# Altium schematic sheet Dashboard.SchDoc
size A
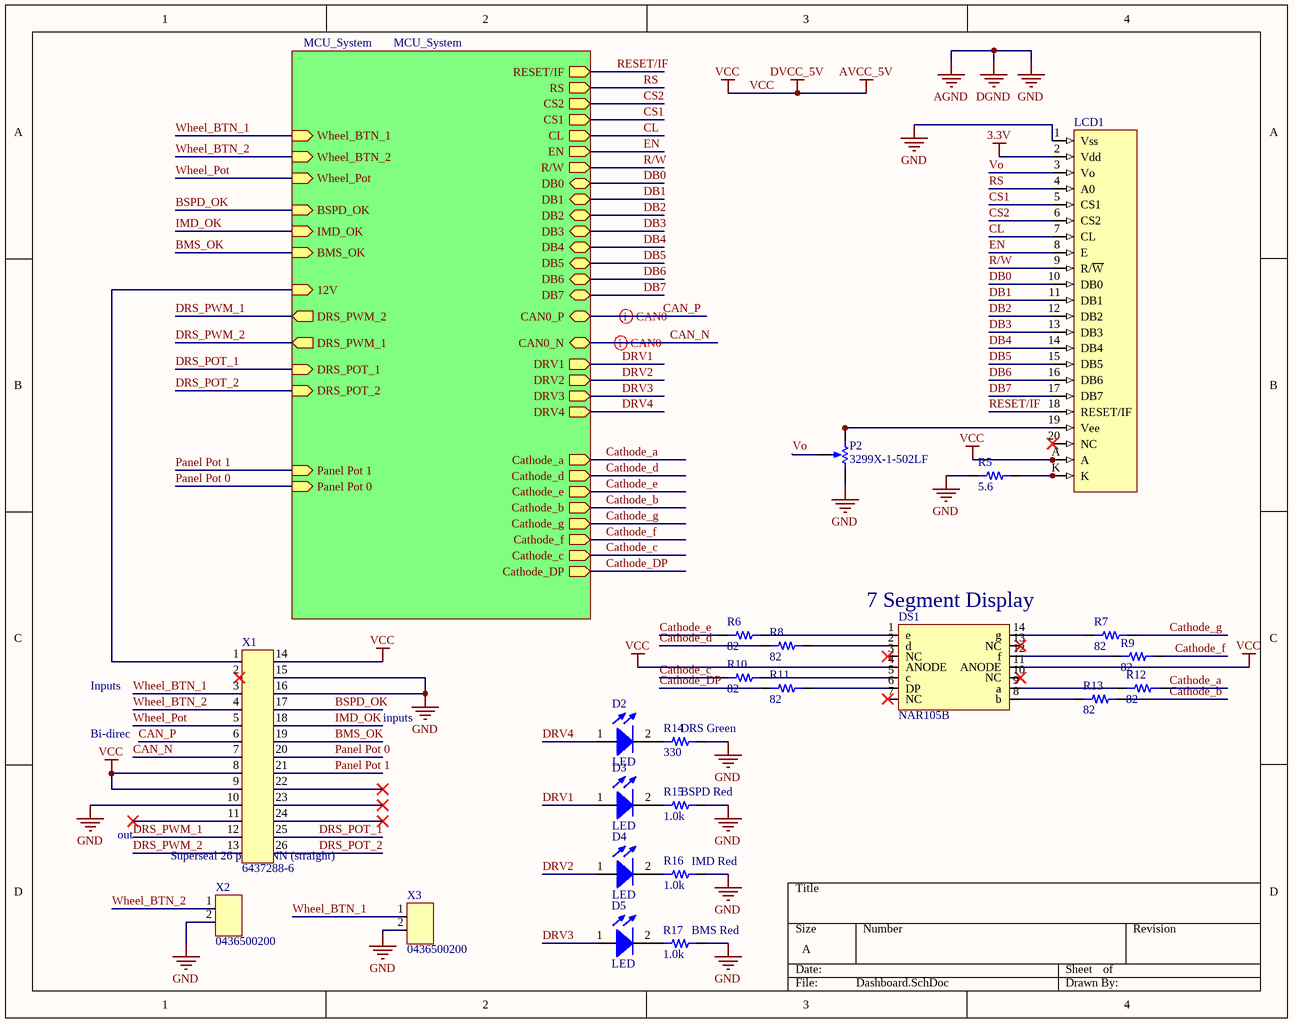
[diagram p0: Dashboard.SchDoc]

## Parts
D2  LED  [LED TH]
D3  LED  [LED TH]
D4  LED  [LED TH]
D5  LED  [LED TH]
DS1  NAR105B  [Stanley7Seg]
LCD1  (no value)  [NHD-12232]
P2  3299X-1-502LF  [3299X-1-502LF]
R5  value 5.6  [RES 0805/2012]  (hidden comment: Resistor 5.6 0805 1/2W 1%)
R6  value 82  [RES 0805/2012]  (hidden comment: Resistor 82 0805 1/4W 5%)
R7  value 82  [RES 0805/2012]  (hidden comment: Resistor 82 0805 1/4W 5%)
R8  value 82  [RES 0805/2012]  (hidden comment: Resistor 82 0805 1/4W 5%)
R9  value 82  [RES 0805/2012]  (hidden comment: Resistor 82 0805 1/4W 5%)
R10  value 82  [RES 0805/2012]  (hidden comment: Resistor 82 0805 1/4W 5%)
R11  value 82  [RES 0805/2012]  (hidden comment: Resistor 82 0805 1/4W 5%)
R12  value 82  [RES 0805/2012]  (hidden comment: Resistor 82 0805 1/4W 5%)
R13  value 82  [RES 0805/2012]  (hidden comment: Resistor 82 0805 1/4W 5%)
R14  value 330  [RES 0805/2012]  (hidden comment: Resistor 330 0805 1/4W 5%)
R15  value 1.0k  [RES 0805/2012]  (hidden comment: Resistor 1.0k 0805 1/4W 5%)
R16  value 1.0k  [RES 0805/2012]  (hidden comment: Resistor 1.0k 0805 1/4W 5%)
R17  value 1.0k  [RES 0805/2012]  (hidden comment: Resistor 1.0k 0805 1/4W 5%)
X1  6437288-6  [TE_Amp_6437288-6]
X2  0436500200  [CONN 43650-0200 MOLEX 2PIN]
X3  0436500200  [CONN 43650-0200 MOLEX 2PIN]

## Sub-sheets
MCU_System = MCU_System: Wheel_BTN_2 (in), Wheel_BTN_1 (in), Wheel_Pot (in), CAN0_N (bidir), CAN0_P (bidir), 12V (in), DRS_PWM_2 (out), DRS_PWM_1 (out), BMS_OK (in), IMD_OK (in), BSPD_OK (in), EN (out), R/W (out), CS2 (out), CS1 (out), RS (out), RESET/IF (out), CL (out), DRV2 (out), DRV3 (out), DRV1 (out), DRS_POT_1 (in), DRS_POT_2 (in), DB7 (bidir), DB3 (bidir), DB4 (bidir), DB5 (bidir), DB6 (bidir), DB1 (bidir), DB2 (bidir), DB0 (bidir), DRV4 (out), Cathode_a (out), Cathode_d (out), Cathode_e (out), Cathode_b (out), Cathode_g (out), Cathode_f (out), Cathode_c (out), Cathode_DP (out), Panel Pot 1 (in), Panel Pot 0 (in)

## Nets
3.3V: LCD1.2(Vdd)
AGND: LCD1.1(Vss) P2.3(BOT) R5.1 R14.2 R15.2 R16.2 R17.2 X1.10 X1.15 X1.16 X2.2 X3.2  [also labelled DGND, GND]
VCC: DS1.4(ANODE) DS1.11(ANODE) LCD1.A LCD1.A2(A) X1.8 X1.9 X1.14  [also labelled AVCC_5V, DVCC_5V]
BMS_OK: X1.19 ; sheet MCU_System/BMS_OK
BSPD_OK: X1.17 ; sheet MCU_System/BSPD_OK
CAN_N: X1.7 ; sheet MCU_System/CAN0_N
CAN_P: X1.6 ; sheet MCU_System/CAN0_P
Cathode_a: R12.2 ; sheet MCU_System/Cathode_a
Cathode_b: R13.2 ; sheet MCU_System/Cathode_b
Cathode_c: R10.1 ; sheet MCU_System/Cathode_c
Cathode_d: R8.1 ; sheet MCU_System/Cathode_d
Cathode_DP: R11.1 ; sheet MCU_System/Cathode_DP
Cathode_e: R6.1 ; sheet MCU_System/Cathode_e
Cathode_f: R9.2 ; sheet MCU_System/Cathode_f
Cathode_g: R7.2 ; sheet MCU_System/Cathode_g
CL: LCD1.7(CL) ; sheet MCU_System/CL
CS1: LCD1.5(CS1) ; sheet MCU_System/CS1
CS2: LCD1.6(CS2) ; sheet MCU_System/CS2
DB0: LCD1.10(DB0) ; sheet MCU_System/DB0
DB1: LCD1.11(DB1) ; sheet MCU_System/DB1
DB2: LCD1.12(DB2) ; sheet MCU_System/DB2
DB3: LCD1.13(DB3) ; sheet MCU_System/DB3
DB4: LCD1.14(DB4) ; sheet MCU_System/DB4
DB5: LCD1.15(DB5) ; sheet MCU_System/DB5
DB6: LCD1.16(DB6) ; sheet MCU_System/DB6
DB7: LCD1.17(DB7) ; sheet MCU_System/DB7
DRS_POT_1: X1.25 ; sheet MCU_System/DRS_POT_1
DRS_POT_2: X1.26 ; sheet MCU_System/DRS_POT_2
DRS_PWM_1: X1.12 ; sheet MCU_System/DRS_PWM_2
DRS_PWM_2: X1.13 ; sheet MCU_System/DRS_PWM_1
DRV1: D3.1(A) ; sheet MCU_System/DRV1
DRV2: D4.1(A) ; sheet MCU_System/DRV2
DRV3: D5.1(A) ; sheet MCU_System/DRV3
DRV4: D2.1(A) ; sheet MCU_System/DRV4
EN: LCD1.8(E) ; sheet MCU_System/EN
IMD_OK: X1.18 ; sheet MCU_System/IMD_OK
Panel Pot 0: X1.20 ; sheet MCU_System/Panel Pot 0
Panel Pot 1: X1.21 ; sheet MCU_System/Panel Pot 1
R/W: LCD1.9(R/~{W}) ; sheet MCU_System/R/W
RESET/IF: LCD1.18(RESET/IF) ; sheet MCU_System/RESET/IF
RS: LCD1.4(A0) ; sheet MCU_System/RS
Vo: LCD1.3(Vo) P2.2(TAP)
Wheel_BTN_1: X1.3 X3.1 ; sheet MCU_System/Wheel_BTN_1
Wheel_BTN_2: X1.4 X2.1 ; sheet MCU_System/Wheel_BTN_2
Wheel_Pot: X1.5 ; sheet MCU_System/Wheel_Pot
NetD2_2: D2.2(K) R14.1
NetD3_2: D3.2(K) R15.1
NetD4_2: D4.2(K) R16.1
NetD5_2: D5.2(K) R17.1
NetDS1_1: DS1.1(e) R6.2
NetDS1_2: DS1.2(d) R8.2
NetDS1_5: DS1.5(c) R10.2
NetDS1_6: DS1.6(DP) R11.2
NetDS1_8: DS1.8(b) R13.1
NetDS1_9: DS1.9(a) R12.1
NetDS1_12: DS1.12(f) R9.1
NetDS1_14: DS1.14(g) R7.1
NetLCD1_19: LCD1.19(Vee) P2.1(TOP)
NetLCD1_K: LCD1.K LCD1.K2(K) R5.2
NetX1_1: X1.1 ; sheet MCU_System/12V

Not connected (* = marked no-connect by the designer): DS1 3(NC)* 7(NC)* 10(NC)* 13(NC)*; LCD1 20(NC)*; X1 2* 11* 22* 23* 24*

## Layout directives
differential pair; rule Matched Net Lengths [Tolerance = 25.4mm]: CAN_N, CAN_P

## Notes on the sheet
- (near DS1) 7 Segment Display
- Inputs
- Bi-direc
- inputs
- (near R14) DRS Green
- out
- (near R15) BSPD Red
- (near X1) Superseal 26 pin CONN (straight)
- (near R16) IMD Red
- (near R17) BMS Red

## Library data of the parts
D2 = 4: LED GREEN DIFFUSED T/H; Manufacturer_id: 1; MfrPartNo: LTL-10233W; idLED: 4; Name: LED_TH_GREEN; Vf: 2.1V; Drawer_id: 1; Value: Green; Package: TH; Link: https://www.digikey.com/products/en?mpart=LTL-10233W&v=160
D3-D5 = 3: LED RED DIFFUSED T/H; Manufacturer_id: 1; MfrPartNo: LTL2R3KRD-EM; idLED: 3; Name: LED_TH_RED; Brightness: 50mcd; Id: 2mA; Vf: 1.8V; Drawer_id: 1; Value: Red; Package: TH; Link: https://www.digikey.com/products/en?mpart=LTL2R3KRD-EM&v=160
DS1 = 21: Character LED Display Module Red 7-Segment 1 Character Common Anode 3.4V 20mA 1.299" H x 0.898" W x 0.354" D (33.00mm x 22.80mm x 9.00mm) 14-DIP; Manufacturer_id: 7; idIC_Misc: 21; Drawer_id: 1; Name: 7_Seg_Disp; Type: 7 Segment; Protocol: Multiplexed; Vin(Max): 3.3V; MfrPartNo: NAR105B; Num_Circuits: 1; Package: DIP; Link: https://www.digikey.com/product-detail/en/stanley-electric-co/NAR105B/404-1126-ND/428836
LCD1 = 22: MfrPartNo: NHD-12232WG-EYYH-V#A-ND; Manufacturer_id: 10; idIC_Misc: 22; Drawer_id: 1; Name: NHD-12232 Display; Value: LCD Display; Vin(Min): 2.7V; Vin(Max): 3.3V; ComponentLink1Description: Datasheet; ComponentLink1URL: http://www.newhavendisplay.com/specs/NHD-12232WG-EYYH-VA.pdf
P2 = 6: Manufacturer_id: 1; idTable: 6; Value: 5K; Num_Contacts: 3; Pitch: 2.54mm; Drawer_id: 1; Name: 3299X-1-502LF; MfrPartNo: 3299X-1-502LF; Link: https://www.digikey.com/product-detail/en/bourns-inc/3299X-1-502LF/3299X-502LF-ND/1088167; ComponentLink1Description: Datasheet
R5 = 883: Manufacturer_id: 1; idResistor: 883; Name: Res_5.6_0805_1/2W_1%; Created_By: Nick Mah; Supplier 1: Digi-Key; Drawer_id: 1; Tolerance: 1%; Power: 1/2W; Package: 0805; ComponentLink1Description: Datasheet; Created_Date: 2018-10-20
R6-R13 = 1775: Manufacturer_id: 1; idResistor: 1775; Name: Res_82_0805_1/4W_5%; Created_By: Nick Mah; Supplier 1: Digi-Key; Drawer_id: 1; Tolerance: 5%; Power: 1/4W; Package: 0805; ComponentLink1Description: Datasheet; Created_Date: 2018-10-20
R14 = 1789: Manufacturer_id: 1; idResistor: 1789; Name: Res_330_0805_1/4W_5%; Created_By: Nick Mah; Supplier 1: Digi-Key; Drawer_id: 1; Tolerance: 5%; Power: 1/4W; Package: 0805; ComponentLink1Description: Datasheet; Created_Date: 2018-10-20
R15-R17 = 1801: Manufacturer_id: 1; idResistor: 1801; Name: Res_1.0k_0805_1/4W_5%; Created_By: Nick Mah; Supplier 1: Digi-Key; Drawer_id: 1; Tolerance: 5%; Power: 1/4W; Package: 0805; ComponentLink1Description: Datasheet; Created_Date: 2018-10-20
X1 = 7: Straight Angle 26Pos AMPSeal; Manufacturer_id: 5; idConn: 7; Drawer_id: 1; Name: AMP SuperSeal Straight; Value: CONN; Voltage_Rating: 250V; Num_Contacts: 26; Num_Rows: 4; Pitch: 3mm; Created_By: Nick; MfrPartNo: 6437288-6; Link: https://www.digikey.com/product-detail/en/te-connectivity-amp-connectors/6437288-6/A123256-ND/2329274; ComponentLink1Description: Drawing; ComponentLink1URL: https://www.te.com/commerce/DocumentDelivery/DDEController?Action=srchrtrv&DocNm=1437288-6&DocType=Customer+Drawing&DocLang=JP; Supplier1: Digi-Key; Supplier1PartNo: A123256-ND
X2 X3 = 9: Manufacturer_id: 4; idConn: 9; Drawer_id: 1; Name: Molex 43650_0200; Value: CONN; Num_Contacts: 2; Pitch: 3 mm; Created_By: Nick; MfrPartNo: 0436500200; Num_Rows: 1; Link: https://www.digikey.com/product-detail/en/molex-llc/0436500200/WM1860-ND/268989; ComponentLink1Description: Datasheet; ComponentLink1URL: https://www.molex.com/pdm_docs/sd/436500200_sd.pdf; Supplier1: Digi-Key; Supplier1PartNo: WM1860-ND